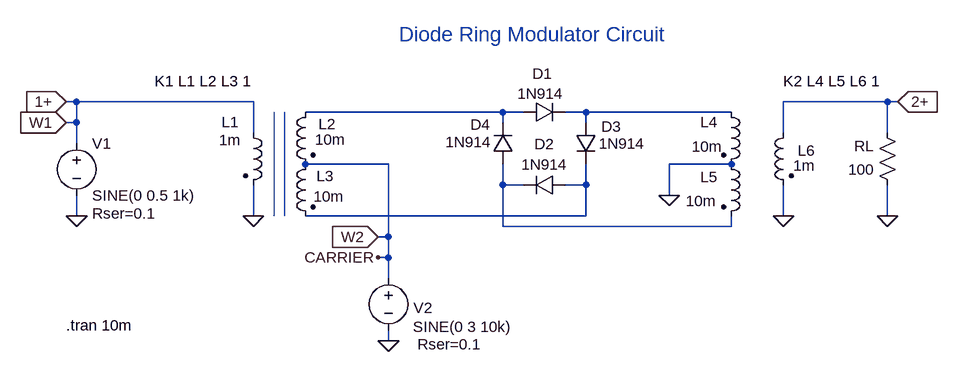
[diagram p0: schematic traditional_ring_modulator.asc]
traditional_ring_modulator.asc, the LTspice schematic file:
Version 4.1
SHEET 1 1436 680
WIRE 80 64 64 64
WIRE 352 64 80 64
WIRE 1328 64 1168 64
WIRE 1344 64 1328 64
WIRE 736 80 432 80
WIRE 768 80 736 80
WIRE 864 80 832 80
WIRE 1088 80 864 80
WIRE 80 96 80 64
WIRE 80 96 64 96
WIRE 736 96 736 80
WIRE 864 96 864 80
WIRE 352 112 352 64
WIRE 1168 112 1168 64
WIRE 1328 112 1328 64
WIRE 80 128 80 96
WIRE 560 160 432 160
WIRE 1088 160 992 160
WIRE 736 192 736 160
WIRE 768 192 736 192
WIRE 864 192 864 160
WIRE 864 192 832 192
WIRE 992 208 992 160
WIRE 80 240 80 208
WIRE 352 240 352 192
WIRE 864 240 864 192
WIRE 864 240 432 240
WIRE 1168 240 1168 192
WIRE 1328 240 1328 192
WIRE 736 256 736 192
WIRE 1088 256 1088 240
WIRE 1088 256 736 256
WIRE 560 272 560 160
WIRE 560 272 544 272
WIRE 560 304 560 272
WIRE 560 304 544 304
WIRE 560 336 560 304
WIRE 560 432 560 416
FLAG 80 240 0
FLAG 352 240 0
FLAG 1168 240 0
FLAG 1328 240 0
FLAG 560 432 0
FLAG 992 208 0
FLAG 64 64 1+
IOPIN 64 64 In
FLAG 1344 64 2+
IOPIN 1344 64 In
FLAG 64 96 W1
IOPIN 64 96 In
FLAG 544 272 W2
IOPIN 544 272 In
FLAG 544 304 CARRIER
SYMBOL voltage 80 112 R0
WINDOW 123 0 0 Left 0
WINDOW 39 24 124 Left 2
SYMATTR SpiceLine Rser=0.1
SYMATTR InstName V1
SYMATTR Value SINE(0 0.5 1k)
SYMBOL ind2 336 96 R0
WINDOW 0 -33 -1 Left 2
WINDOW 3 -37 27 Left 2
SYMATTR InstName L1
SYMATTR Value 1m
SYMATTR Type ind
SYMBOL ind2 448 64 M0
WINDOW 0 -31 34 Left 2
WINDOW 3 -46 58 Left 2
SYMATTR InstName L2
SYMATTR Value 10m
SYMATTR Type ind
SYMBOL ind2 448 144 M0
WINDOW 0 -28 34 Left 2
WINDOW 3 -44 66 Left 2
SYMATTR InstName L3
SYMATTR Value 10m
SYMATTR Type ind
SYMBOL diode 768 96 R270
WINDOW 0 60 29 VTop 2
WINDOW 3 60 26 VBottom 2
SYMATTR InstName D1
SYMATTR Value 1N914
SYMBOL diode 848 96 R0
WINDOW 0 40 6 Left 2
WINDOW 3 36 32 Left 2
SYMATTR InstName D3
SYMATTR Value 1N914
SYMBOL diode 832 176 R90
WINDOW 0 -31 32 VBottom 2
WINDOW 3 -31 32 VTop 2
SYMATTR InstName D2
SYMATTR Value 1N914
SYMBOL diode 752 160 R180
WINDOW 0 35 61 Left 2
WINDOW 3 33 34 Left 2
SYMATTR InstName D4
SYMATTR Value 1N914
SYMBOL ind2 1184 96 M0
WINDOW 0 -33 43 Left 2
WINDOW 3 -33 66 Left 2
SYMATTR InstName L6
SYMATTR Value 1m
SYMATTR Type ind
SYMBOL ind2 1072 64 R0
WINDOW 0 -32 31 Left 2
WINDOW 3 -45 69 Left 2
SYMATTR InstName L4
SYMATTR Value 10m
SYMATTR Type ind
SYMBOL ind2 1072 144 R0
WINDOW 0 -32 36 Left 2
WINDOW 3 -54 73 Left 2
SYMATTR InstName L5
SYMATTR Value 10m
SYMATTR Type ind
SYMBOL res 1344 208 R180
WINDOW 0 36 76 Left 2
WINDOW 3 36 40 Left 2
SYMATTR InstName RL
SYMATTR Value 100
SYMBOL voltage 560 320 R0
WINDOW 0 53 46 Top 2
WINDOW 3 38 91 Left 2
WINDOW 123 0 0 Left 0
WINDOW 39 94 133 Bottom 2
SYMATTR InstName V2
SYMATTR Value SINE(0 3 10k)
SYMATTR SpiceLine Rser=0.1
TEXT 200 32 Left 2 !K1 L1 L2 L3 1
TEXT 1168 32 Left 2 !K2 L4 L5 L6 1
TEXT 64 408 Left 2 !.tran 10m
TEXT 576 -40 Left 3 ;Diode Ring Modulator Circuit
LINE Normal 384 240 384 80
LINE Normal 400 80 400 240

The netlist it stands for:
* traditional_ring_modulator.asc
V1 W1 0 SINE(0 0.5 1k) Rser=0.1
L1 W1 0 1m
L2 N001 CARRIER 10m
L3 CARRIER N004 10m
D1 N001 N002 1N914
D3 N002 N004 1N914
D2 N004 N003 1N914
D4 N003 N001 1N914
L6 2+ 0 1m
L4 N002 0 10m
L5 0 N003 10m
RL 0 2+ 100
V2 CARRIER 0 SINE(0 3 10k) Rser=0.1
.model D D
.lib standard.dio
K1 L1 L2 L3 1
K2 L4 L5 L6 1
.tran 10m
* Diode Ring Modulator Circuit
.backanno
.end